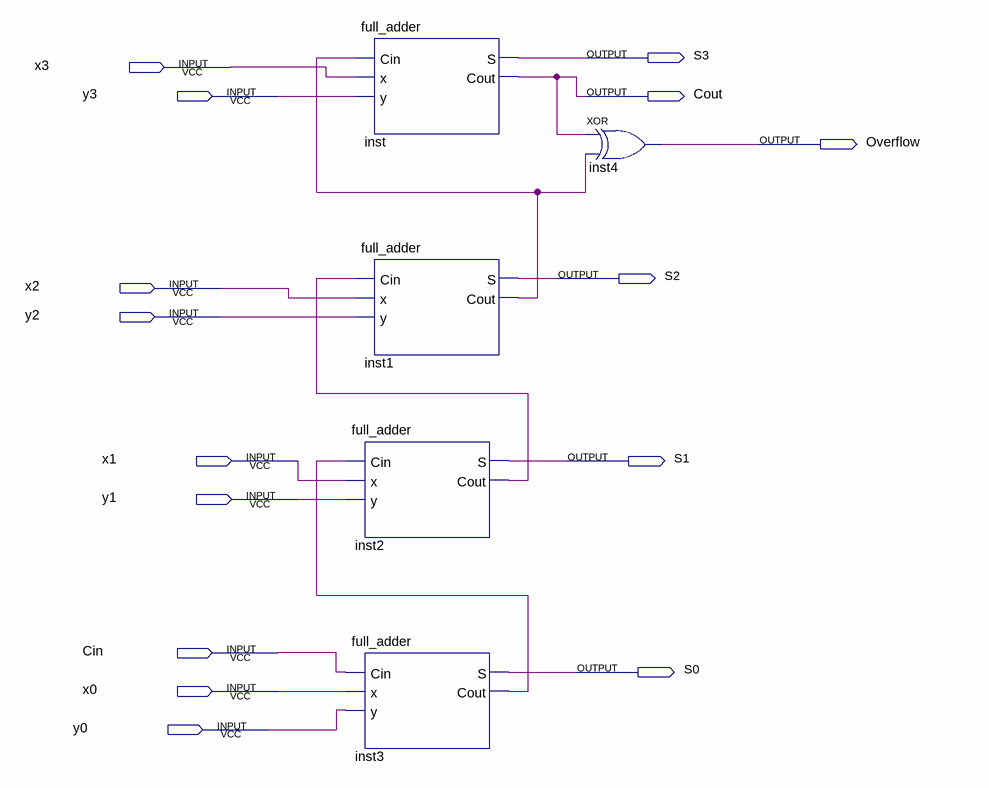
[diagram p0: schematic sheet]
// Quartus schematic adder_4bit.bdf as structural Verilog: 5 symbols, 15 pins
module adder_4bit (
  input  x3,
  input  y3,
  input  x2,
  input  y2,
  input  x1,
  input  y1,
  input  Cin,
  input  x0,
  input  y0,
  output S3,
  output Cout,
  output Overflow,
  output S2,
  output S1,
  output S0
);

  wire inst1_cout, inst2_cout, inst3_cout;

  full_adder inst (.Cin(inst1_cout), .x(x3), .y(y3), .S(S3), .Cout(Cout));
  full_adder inst1 (.Cin(inst2_cout), .x(x2), .y(y2), .S(S2), .Cout(inst1_cout));
  full_adder inst2 (.Cin(inst3_cout), .x(x1), .y(y1), .S(S1), .Cout(inst2_cout));
  full_adder inst3 (.Cin(Cin), .x(x0), .y(y0), .S(S0), .Cout(inst3_cout));
  xor inst4 (Overflow, Cout, inst1_cout);
endmodule
